# Altium project LightLink_V4.PrjPcb (part 1 of 3)
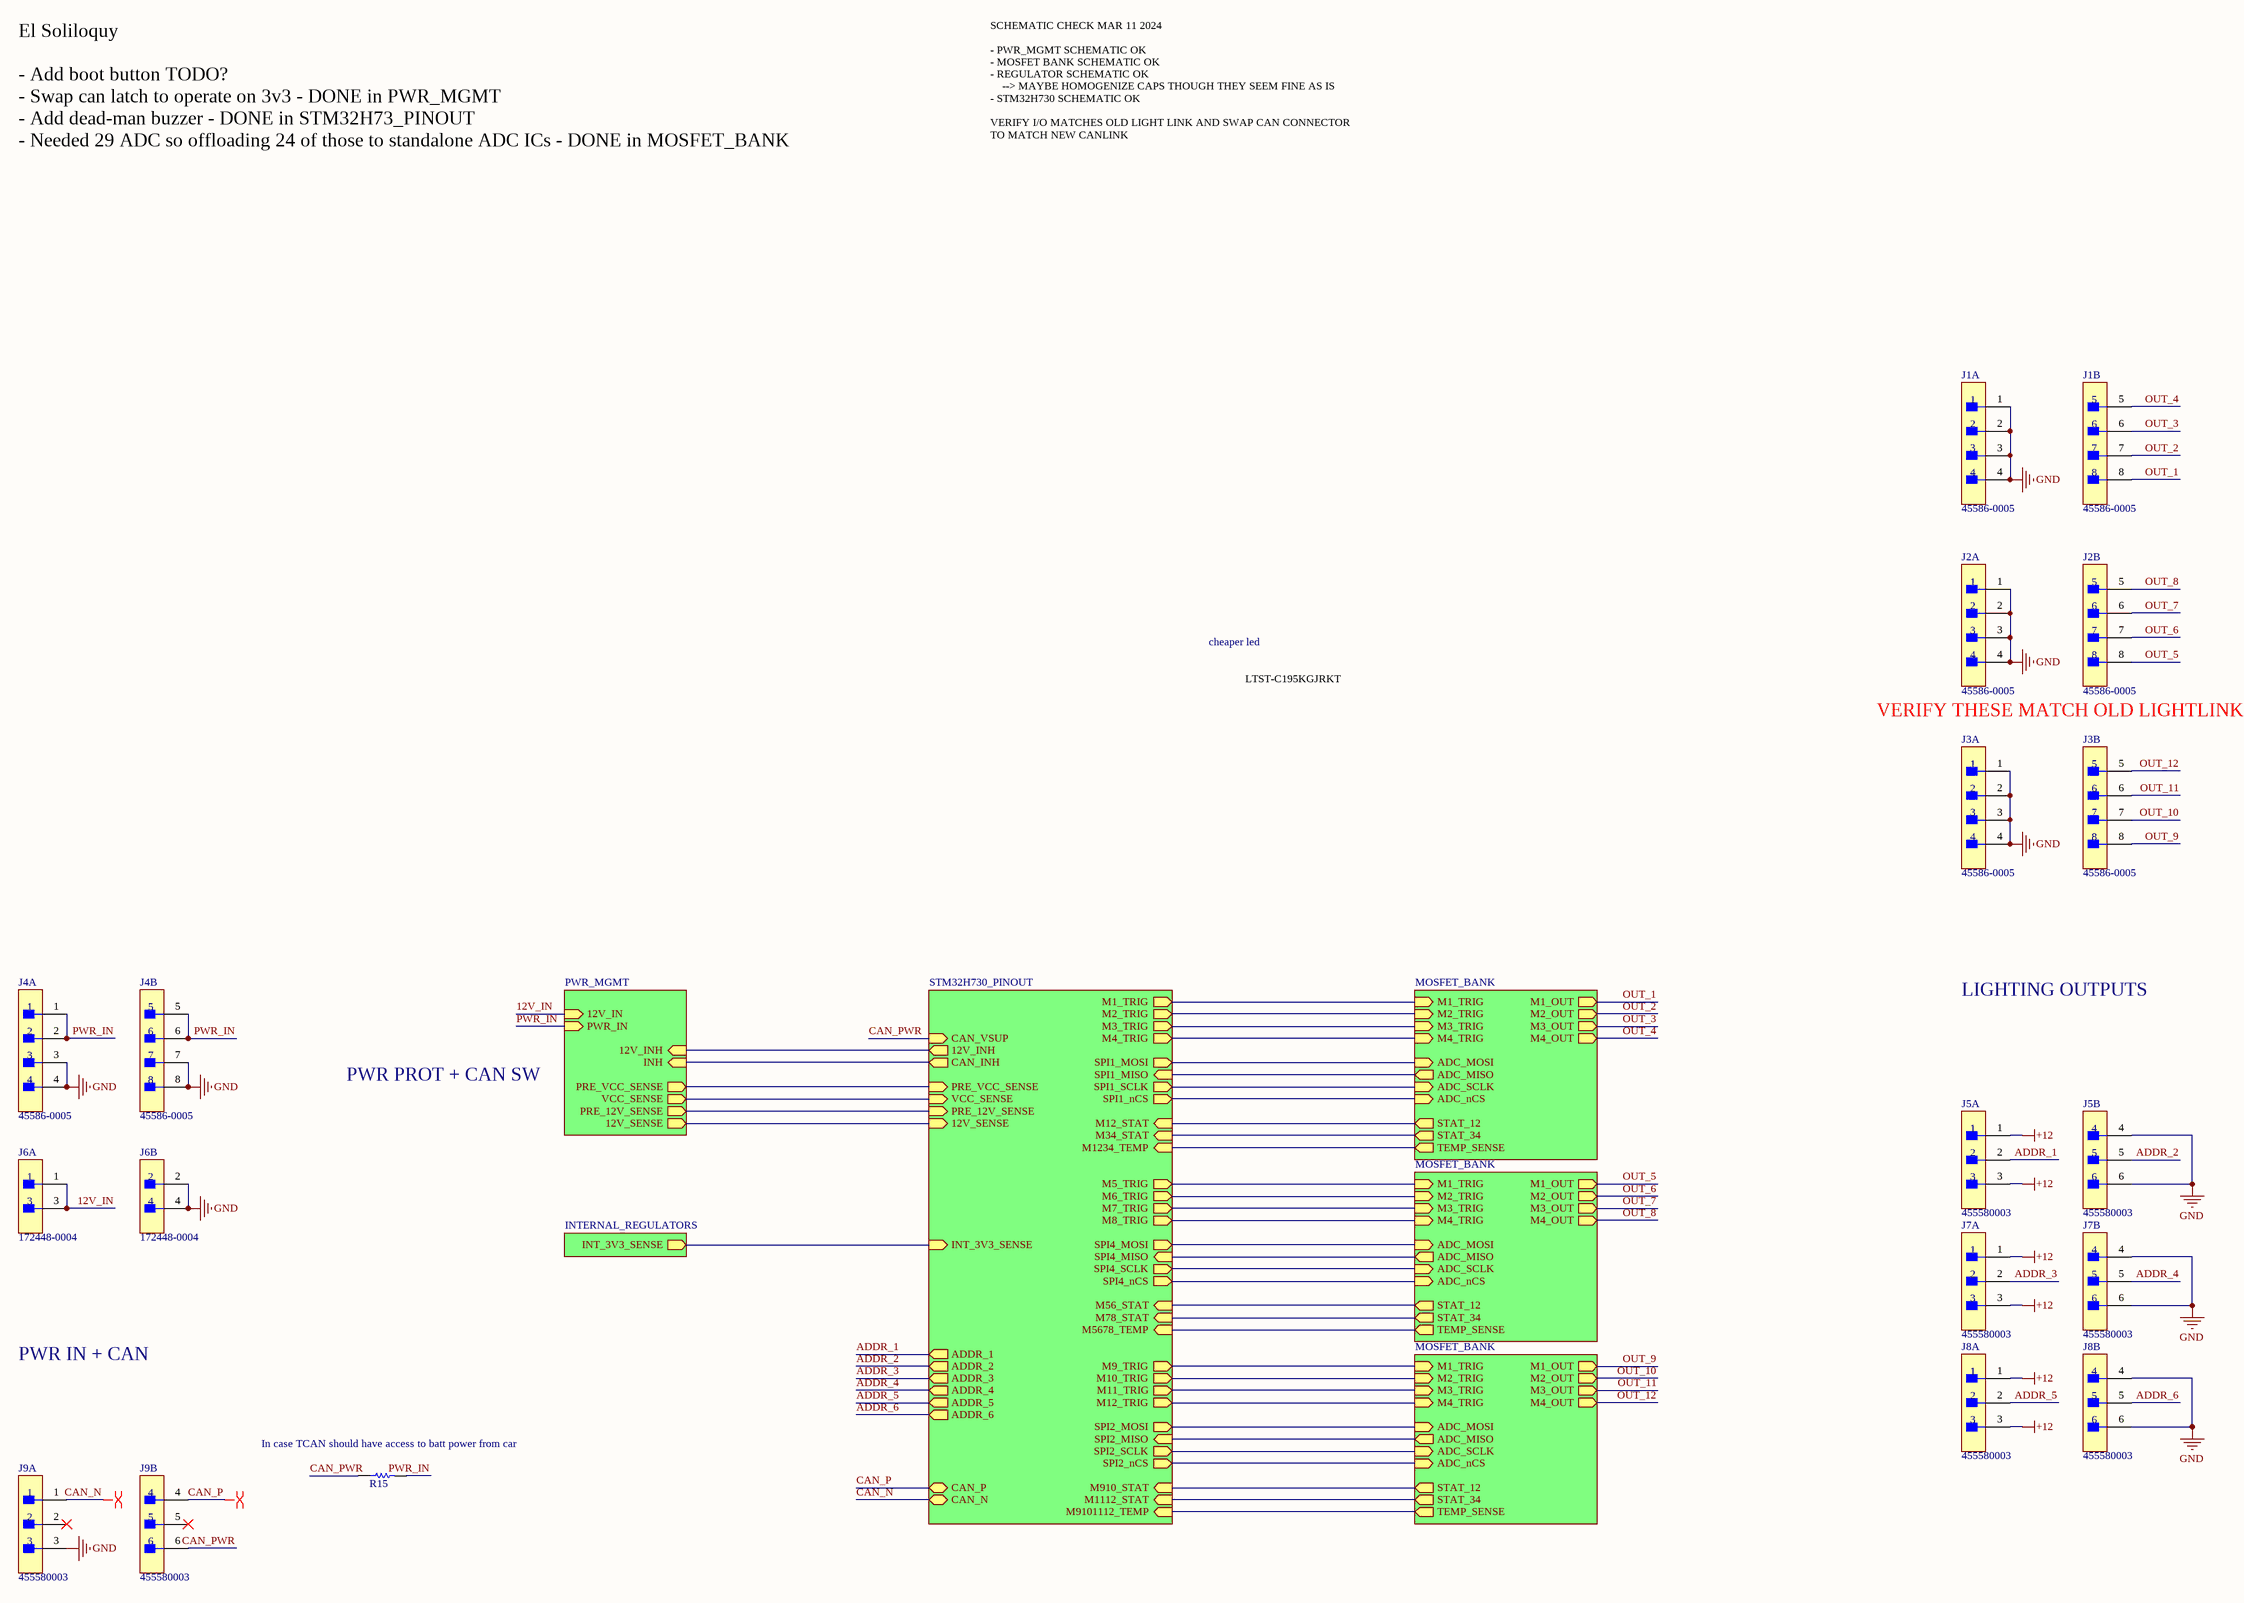
[diagram p0: LightLink_V4.SchDoc]
5 sheets, 331 parts. Net scope: hierarchical (ports join the sheet entries above them; power ports are global).
Board files: LightLink_V4.PcbDoc, LightLink_V4.1.PcbDoc
Sheets:
  LightLink_V4.SchDoc
    PWR_MGMT = PWR_MGMT.SchDoc
    INTERNAL_REGULATORS = INTERNAL_REGULATORS.SchDoc
    STM32H730_PINOUT = STM32H730_PINOUT.SchDoc
    MOSFET_BANK = MOSFET_BANK.SchDoc
    MOSFET_BANK = MOSFET_BANK.SchDoc
    MOSFET_BANK = MOSFET_BANK.SchDoc

## Sheet LightLink_V4.SchDoc
size C; SheetNumber: 1; SheetTotal: 5

### Parts
J1  45586-0005  [FP-45586-0005-MFG]  (parts A,B of 2)
J2  45586-0005  [FP-45586-0005-MFG]  (parts A,B of 2)
J3  45586-0005  [FP-45586-0005-MFG]  (parts A,B of 2)
J4  45586-0005  [FP-45586-0005-MFG]  (parts A,B of 2)
J5  455580003  [FP-455580003-MFG]  (parts A,B of 2)
J6  172448-0004  [FP-39-30-1041-MFG]  (parts A,B of 2)
J7  455580003  [FP-455580003-MFG]  (parts A,B of 2)
J8  455580003  [FP-455580003-MFG]  (parts A,B of 2)
J9  455580003  [FP-455580003-MFG]  (parts A,B of 2)
R15  0603 JUMPER  [RESC1609X55X30ML15T15]  (value not drawn)

### Sub-sheets
INTERNAL_REGULATORS = INTERNAL_REGULATORS: INT_3V3_SENSE (out)
MOSFET_BANK = MOSFET_BANK: M1_OUT (out), M2_OUT (out), M3_OUT (out), M4_OUT (out), M1_TRIG (in), M2_TRIG (in), M3_TRIG (in), M4_TRIG (in), STAT_12 (out), STAT_34 (out), ADC_MOSI (in), ADC_MISO (out), ADC_SCLK (in), ADC_nCS (in), TEMP_SENSE (out)
MOSFET_BANK = MOSFET_BANK: M1_OUT (out), M2_OUT (out), M3_OUT (out), M4_OUT (out), M1_TRIG (in), M2_TRIG (in), M3_TRIG (in), M4_TRIG (in), STAT_12 (out), STAT_34 (out), ADC_MOSI (in), ADC_MISO (out), ADC_SCLK (in), ADC_nCS (in), TEMP_SENSE (out)
MOSFET_BANK = MOSFET_BANK: M1_OUT (out), M2_OUT (out), M3_OUT (out), M4_OUT (out), M1_TRIG (in), M2_TRIG (in), M3_TRIG (in), M4_TRIG (in), STAT_12 (out), STAT_34 (out), ADC_MOSI (in), ADC_MISO (out), ADC_SCLK (in), ADC_nCS (in), TEMP_SENSE (out)
PWR_MGMT = PWR_MGMT: PWR_IN (in), 12V_IN (in), PRE_VCC_SENSE (out), VCC_SENSE (out), PRE_12V_SENSE (out), 12V_SENSE (out), INH (in), 12V_INH (in)
STM32H730_PINOUT = STM32H730_PINOUT: CAN_P (bidir), CAN_N (bidir), M1_TRIG (out), M2_TRIG (out), M3_TRIG (out), M4_TRIG (out), M12_STAT (in), M34_STAT (in), PRE_VCC_SENSE (in), VCC_SENSE (in), PRE_12V_SENSE (in), 12V_SENSE (in), M5_TRIG (out), M6_TRIG (out), M7_TRIG (out), M8_TRIG (out), M9_TRIG (out), M10_TRIG (out), M11_TRIG (out), M12_TRIG (out), M56_STAT (in), M78_STAT (in), M910_STAT (in), M1112_STAT (in), INT_3V3_SENSE (in), ADDR_1 (out), ADDR_2 (out), ADDR_3 (out), ADDR_4 (out), ADDR_5 (out), ADDR_6 (out), CAN_VSUP (in), CAN_INH (out), SPI1_MOSI (out), SPI1_MISO (in), SPI1_SCLK (out), SPI1_nCS (out), SPI4_MOSI (out), SPI4_MISO (in), SPI4_SCLK (out), SPI4_nCS (out), SPI2_MOSI (out), SPI2_MISO (in), SPI2_SCLK (out), SPI2_nCS (out), M1234_TEMP (in), M5678_TEMP (in), M9101112_TEMP (in), 12V_INH (out)

### Nets
+12: J5.1 J5.3 J7.1 J7.3 J8.1 J8.3
GND: J1.1 J1.2 J1.3 J1.4 J2.1 J2.2 J2.3 J2.4 J3.1 J3.2 J3.3 J3.4 J4.3 J4.4 J4.7 J4.8 J5.4 J5.6 J6.2 J6.4 J7.4 J7.6 J8.4 J8.6 J9.3
12V_IN: J6.1 J6.3 ; sheet PWR_MGMT/12V_IN
12V_INH: sheet PWR_MGMT/12V_INH, sheet STM32H730_PINOUT/12V_INH
12V_SENSE: sheet PWR_MGMT/12V_SENSE, sheet STM32H730_PINOUT/12V_SENSE
ADC_MISO: sheet STM32H730_PINOUT/SPI4_MISO, sheet MOSFET_BANK/ADC_MISO
ADC_MISO: sheet STM32H730_PINOUT/SPI1_MISO, sheet MOSFET_BANK/ADC_MISO  [a separate net that carries the same name]
ADC_MISO: sheet STM32H730_PINOUT/SPI2_MISO, sheet MOSFET_BANK/ADC_MISO  [a separate net that carries the same name]
ADC_MOSI: sheet STM32H730_PINOUT/SPI4_MOSI, sheet MOSFET_BANK/ADC_MOSI
ADC_MOSI: sheet STM32H730_PINOUT/SPI1_MOSI, sheet MOSFET_BANK/ADC_MOSI  [a separate net that carries the same name]
ADC_MOSI: sheet STM32H730_PINOUT/SPI2_MOSI, sheet MOSFET_BANK/ADC_MOSI  [a separate net that carries the same name]
ADC_nCS: sheet STM32H730_PINOUT/SPI4_nCS, sheet MOSFET_BANK/ADC_nCS
ADC_nCS: sheet STM32H730_PINOUT/SPI1_nCS, sheet MOSFET_BANK/ADC_nCS  [a separate net that carries the same name]
ADC_nCS: sheet STM32H730_PINOUT/SPI2_nCS, sheet MOSFET_BANK/ADC_nCS  [a separate net that carries the same name]
ADC_SCLK: sheet STM32H730_PINOUT/SPI4_SCLK, sheet MOSFET_BANK/ADC_SCLK
ADC_SCLK: sheet STM32H730_PINOUT/SPI1_SCLK, sheet MOSFET_BANK/ADC_SCLK  [a separate net that carries the same name]
ADC_SCLK: sheet STM32H730_PINOUT/SPI2_SCLK, sheet MOSFET_BANK/ADC_SCLK  [a separate net that carries the same name]
ADDR_1: J5.2 ; sheet STM32H730_PINOUT/ADDR_1
ADDR_2: J5.5 ; sheet STM32H730_PINOUT/ADDR_2
ADDR_3: J7.2 ; sheet STM32H730_PINOUT/ADDR_3
ADDR_4: J7.5 ; sheet STM32H730_PINOUT/ADDR_4
ADDR_5: J8.2 ; sheet STM32H730_PINOUT/ADDR_5
ADDR_6: J8.5 ; sheet STM32H730_PINOUT/ADDR_6
CAN_INH: sheet PWR_MGMT/INH, sheet STM32H730_PINOUT/CAN_INH
CAN_N: J9.1 ; sheet STM32H730_PINOUT/CAN_N
CAN_P: J9.4 ; sheet STM32H730_PINOUT/CAN_P
CAN_PWR: J9.6 R15.1 ; sheet STM32H730_PINOUT/CAN_VSUP
INT_3V3_SENSE: sheet INTERNAL_REGULATORS/INT_3V3_SENSE, sheet STM32H730_PINOUT/INT_3V3_SENSE
M1_TRIG: sheet STM32H730_PINOUT/M1_TRIG, sheet MOSFET_BANK/M1_TRIG
M2_TRIG: sheet STM32H730_PINOUT/M2_TRIG, sheet MOSFET_BANK/M2_TRIG
M3_TRIG: sheet STM32H730_PINOUT/M3_TRIG, sheet MOSFET_BANK/M3_TRIG
M4_TRIG: sheet STM32H730_PINOUT/M4_TRIG, sheet MOSFET_BANK/M4_TRIG
M5_TRIG: sheet STM32H730_PINOUT/M5_TRIG, sheet MOSFET_BANK/M1_TRIG
M6_TRIG: sheet STM32H730_PINOUT/M6_TRIG, sheet MOSFET_BANK/M2_TRIG
M7_TRIG: sheet STM32H730_PINOUT/M7_TRIG, sheet MOSFET_BANK/M3_TRIG
M8_TRIG: sheet STM32H730_PINOUT/M8_TRIG, sheet MOSFET_BANK/M4_TRIG
M9_TRIG: sheet STM32H730_PINOUT/M9_TRIG, sheet MOSFET_BANK/M1_TRIG
M10_TRIG: sheet STM32H730_PINOUT/M10_TRIG, sheet MOSFET_BANK/M2_TRIG
M11_TRIG: sheet STM32H730_PINOUT/M11_TRIG, sheet MOSFET_BANK/M3_TRIG
M12_STAT: sheet STM32H730_PINOUT/M12_STAT, sheet MOSFET_BANK/STAT_12
M12_TRIG: sheet STM32H730_PINOUT/M12_TRIG, sheet MOSFET_BANK/M4_TRIG
M34_STAT: sheet STM32H730_PINOUT/M34_STAT, sheet MOSFET_BANK/STAT_34
M56_STAT: sheet STM32H730_PINOUT/M56_STAT, sheet MOSFET_BANK/STAT_12
M78_STAT: sheet STM32H730_PINOUT/M78_STAT, sheet MOSFET_BANK/STAT_34
M910_STAT: sheet STM32H730_PINOUT/M910_STAT, sheet MOSFET_BANK/STAT_12
M1112_STAT: sheet STM32H730_PINOUT/M1112_STAT, sheet MOSFET_BANK/STAT_34
M1234_TEMP: sheet STM32H730_PINOUT/M1234_TEMP, sheet MOSFET_BANK/TEMP_SENSE
M5678_TEMP: sheet STM32H730_PINOUT/M5678_TEMP, sheet MOSFET_BANK/TEMP_SENSE
M9101112_TEMP: sheet STM32H730_PINOUT/M9101112_TEMP, sheet MOSFET_BANK/TEMP_SENSE
OUT_1: J1.8 ; sheet MOSFET_BANK/M1_OUT  [project net M1_OUT]
OUT_2: J1.7 ; sheet MOSFET_BANK/M2_OUT  [project net M2_OUT]
OUT_3: J1.6 ; sheet MOSFET_BANK/M3_OUT  [project net M3_OUT]
OUT_4: J1.5 ; sheet MOSFET_BANK/M4_OUT  [project net M4_OUT]
OUT_5: J2.8 ; sheet MOSFET_BANK/M1_OUT  [project net M1_OUT]
OUT_6: J2.7 ; sheet MOSFET_BANK/M2_OUT  [project net M2_OUT]
OUT_7: J2.6 ; sheet MOSFET_BANK/M3_OUT  [project net M3_OUT]
OUT_8: J2.5 ; sheet MOSFET_BANK/M4_OUT  [project net M4_OUT]
OUT_9: J3.8 ; sheet MOSFET_BANK/M1_OUT  [project net M1_OUT]
OUT_10: J3.7 ; sheet MOSFET_BANK/M2_OUT  [project net M2_OUT]
OUT_11: J3.6 ; sheet MOSFET_BANK/M3_OUT  [project net M3_OUT]
OUT_12: J3.5 ; sheet MOSFET_BANK/M4_OUT  [project net M4_OUT]
PRE_12V_SENSE: sheet PWR_MGMT/PRE_12V_SENSE, sheet STM32H730_PINOUT/PRE_12V_SENSE
PRE_VCC_SENSE: sheet PWR_MGMT/PRE_VCC_SENSE, sheet STM32H730_PINOUT/PRE_VCC_SENSE
PWR_IN: J4.1 J4.2 J4.5 J4.6 R15.2 ; sheet PWR_MGMT/PWR_IN
VCC_SENSE: sheet PWR_MGMT/VCC_SENSE, sheet STM32H730_PINOUT/VCC_SENSE

Not connected (* = marked no-connect by the designer): J9 2* 5*

### Layout directives
differential pair: CAN_N, CAN_P

### Notes on the sheet
- SCHEMATIC CHECK MAR 11 2024
  - PWR_MGMT SCHEMATIC OK
  - MOSFET BANK SCHEMATIC OK
  - REGULATOR SCHEMATIC OK
  --> MAYBE HOMOGENIZE CAPS THOUGH THEY SEEM FINE AS IS
  - STM32H730 SCHEMATIC OK
  VERIFY I/O MATCHES OLD LIGHT LINK AND SWAP CAN CONNECTOR TO MATCH NEW CANLINK
- cheaper led
- LTST-C195KGJRKT
- (near J2) VERIFY THESE MATCH OLD LIGHTLINK
- El Soliloquy
  - Add boot button TODO?
  - Swap can latch to operate on 3v3 - DONE in PWR_MGMT
  - Add dead-man buzzer - DONE in STM32H73_PINOUT
  - Needed 29 ADC so offloading 24 of those to standalone ADC ICs - DONE in MOSFET_BANK
- LIGHTING OUTPUTS
- PWR PROT + CAN SW
- PWR IN + CAN
- (near R15) In case TCAN should have access to batt power from car

### Library data of the parts
J1-J4 = CMP-04776-000690-1: CONN HEADER R/A 8POS 4.2MM
J5 J7-J9 = CMP-04776-000024-1: CONN HEADER R/A 6POS 4.2MM; Manufacturer: Molex; Standoff Height: 0.4mm; Conn Orientation: Right Angle; Number Of Contacts: 6; Conn Gender: Male; Voltage Rating: 600V; Current Rating: 8A; Footprint Url: https://www.molex.com/pdm_docs/sd/455580003_sd.pdf; Number Of Rows: 2; Lead Free: Yes; Digikey Description: CONN HEADER R/A 6POS 4.2MM; ComponentLink2URL: https://www.molex.com/webdocs/datasheets/pdf/en-us/0455580003_PCB_HEADERS.pdf; Octopart: https://octopart.com/45558-0003-molex-7672845; Package: 0; Device Class L3: unset; ComponentLink2Description: Datasheet; Device Class L2: Headers and Wire Housings; Category: Conn; Contact Material: Tin,Nickel; Mouser Description: Conn Power HDR 6 POS 4.2mm Solder ST Thru-Hole 6 Terminal 1 Port Mini-Fit Jr™ Tray; Manufacturer Part Number: 455580003; Pitch: 4.2mm; Device Class L1: Connectors; Temperature Range Low: -40°C; Temperature: -40°C to +105°C; RoHS: TRUE; Temperature Range High: +105°C; Height: 10.38mm; Automotive: No
J6 = CMP-04776-000047-1: Different component but holes should line up. Original P/N is 39-30-1041; Manufacturer: Molex; Old_Part_Number: 5569-04A2G; Keying_to_Mating_Part: None; Circuits_maximum: 4; First_Mate__Last_Break: No; Lead_freeProcess_Capability: WAVE; Duration_at_Max_Process_Temperature_seconds: 005; Sales_Drawing: SDA-5569-NA2*-*; Current Rating: 13A; Material___Plating_Mating: Gold; Conn Gender: Male; Test_Summary: TS-5556-002; Color___Resin: Natural; Termination_Interface_Style: Through Hole; Pitch___Termination_Interface: 4.20mm; UL: E29179; PCB_Retention: Yes; Product_Name: Mini-Fit Jr.TM; Material___Resin: Nylon; Overview: Mini-Fit Jr. Power Connectors; CSA: LR19980; Plating_min___Termination: 2.540μm; Packaging_Type: Bag; Number_of_Rows: 2; Durability_mating_cycles_max: 30; Max_Cycles_at_Max_Process_Temperature: 001; Product_Specification: PS-45750-001, PS-5556-001; Net_Weight: 1.529/g; Voltage___Maximum: 600V; Material___Metal: Brass; Pitch: 4.2mm; Packaging_Specification: PK-5569-002; Shrouded: Fully; Plating_min___Mating: 0.762μm; Temperature_Range___Operating: -40°C to +105°C; Current___Maximum_per_Contact: 13.0A; Comments: Current = 13A max. per circuit when header is mated to a receptacle loaded with  45750  Mini-Fit® Plus HCS Crimp Terminal Crimped to 16 AWG wire.,  See Molex Product specification PS-5556-001 for additional current de-rating information.; Process_Temperature_max_C: 240; PCB_Thickness___Recommended: 1.78mm; Standoff Height: 0.016inch; Surface_Mount_Compatible_SMC: No; UPC: 800753579651; Conn Orientation: Right Angle; Material___Plating_Termination: Matte Tin; ComponentLink2Description: Datasheet; Footprint Url: https://www.molex.com/pdm_docs/sd/039301041_sd.pdf; Contact Material: Gold,Nickel; Octopart: https://octopart.com/39-30-1041-molex-276737; Digikey Description: CONN HEADER R/A 4POS 4.2MM; imported: yes; Series: 5569; Mouser Description: Headers & Wire Housings 4 CKT R/A HEADER; Temperature Range High: +105°C; Category: Conn; Polarized_to_Mating_Part: Yes; Pitch___Mating_Interface: 4.20mm; Automotive: No; Guide_to_Mating_Part: No; Lock_to_Mating_Part: Yes; Number Of Contacts: 4; Temperature Range Low: -40°C; RoHS: TRUE; Status: Active; imported_from: 3D Model; ComponentLink2URL: http://www.molex.com/pdm_docs/sd/039301041_sd.pdf; part_page: http://www.molex.com/molex/products/datasheet.jsp?part=active/0039301041_PCB_HEADERS.xml; Temperature: -40°C to +105°C; Device Class L3: unset; Device Class L1: Connectors; Package: 39-30-1041; Circuits_Loaded: 4; Lead Free: Yes; Ipc Land Pattern Name: CAPAD1016W80L630D240; Application: Power, Wire-to-Board; Voltage Rating: 600V; Manufacturer Part Number: 39-30-1041; Breakaway: No; Orientation: Right Angle; Flammability: 94V-2; 3D_model: http://www.molex.com/pdm_docs/stp/39-30-1041_stp.zip; Number Of Rows: 2; Polarized_to_PCB: Yes; Device Class L2: Headers and Wire Housings; Glow_Wire_Compliant: No; Stackable: No; PCB_Locator: Yes
R15 = CMP-009-00209-1: READ THE NAME

## Sheet PWR_MGMT.SchDoc
size C; SheetNumber: 2; SheetTotal: 5
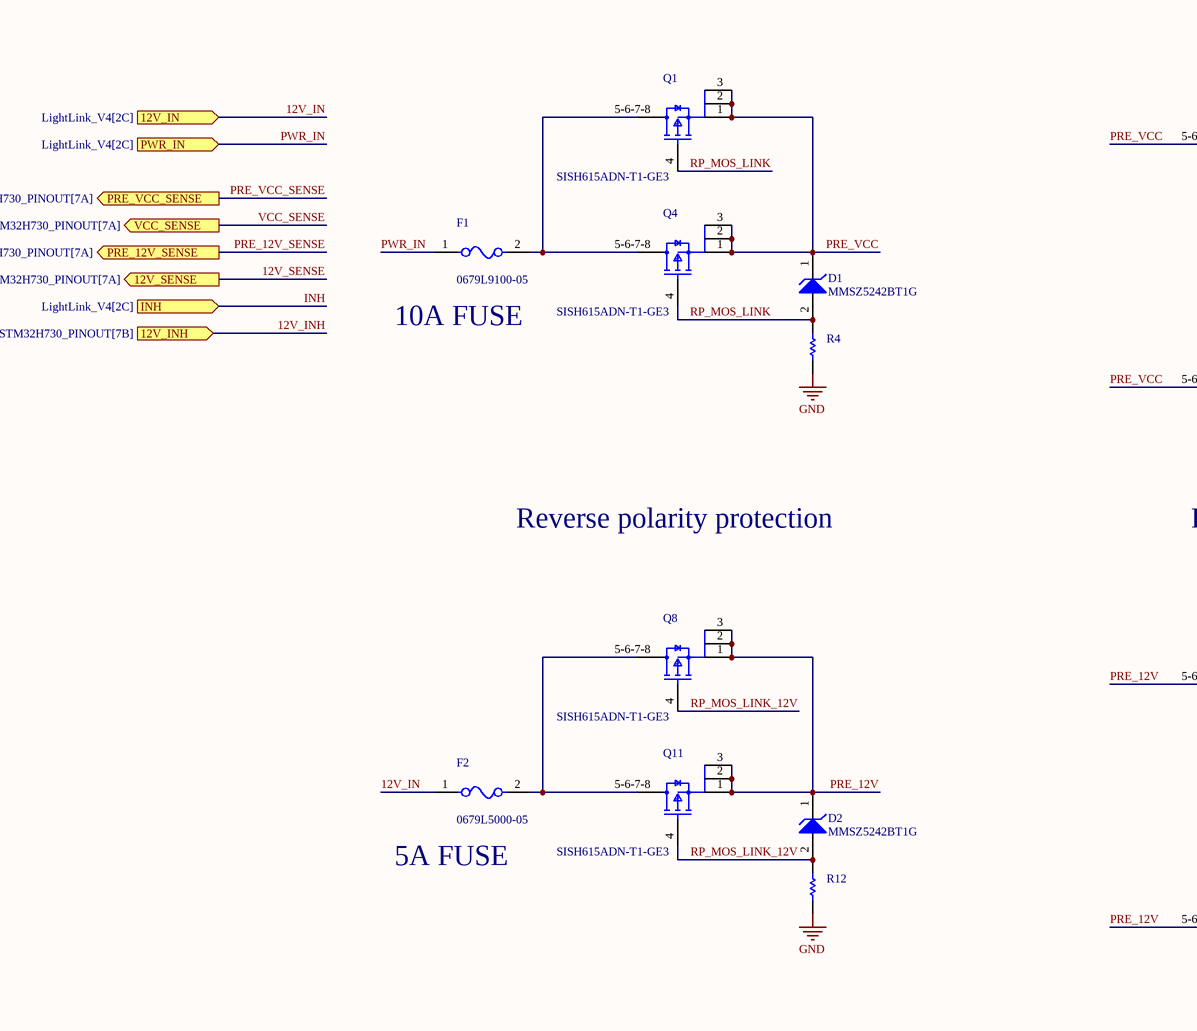
[diagram p1: PWR_MGMT.SchDoc, left]
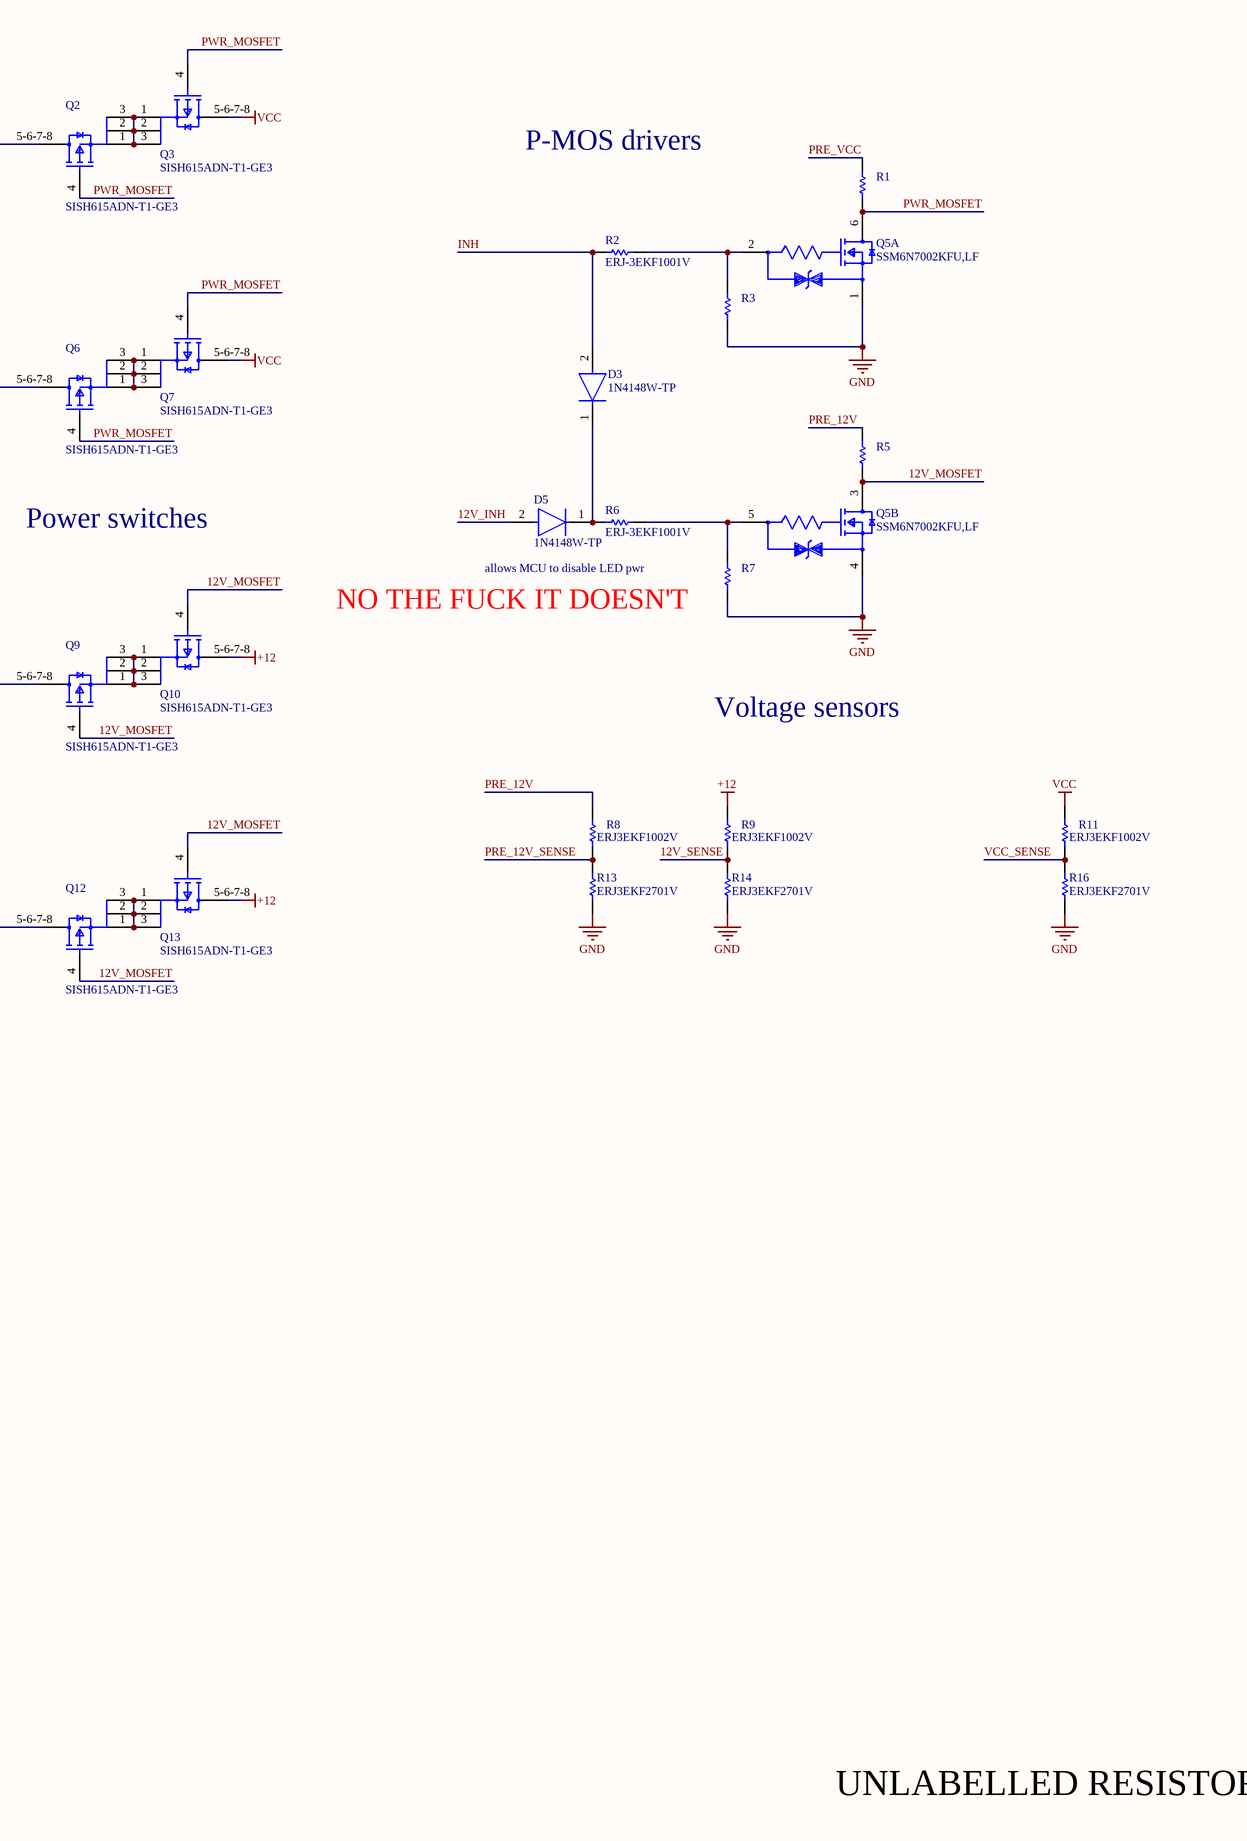
[diagram p2: PWR_MGMT.SchDoc, right]

### Parts
D1  MMSZ5242BT1G  [ONSC-SOD-123-2-425-04_V]
D2  MMSZ5242BT1G  [ONSC-SOD-123-2-425-04_V]
D3  1N4148W-TP  [FP-SOD-123-IPC_A]
D5  1N4148W-TP  [FP-SOD-123-IPC_A]
F1  0679L9100-05  [FP-0679L-MFG]
F2  0679L5000-05  [FP-0679L-MFG]
Q1  SISH615ADN-T1-GE3  [SISH615ADN-T1-GE3-Footprint-1]
Q2  SISH615ADN-T1-GE3  [SISH615ADN-T1-GE3-Footprint-1]
Q3  SISH615ADN-T1-GE3  [SISH615ADN-T1-GE3-Footprint-1]
Q4  SISH615ADN-T1-GE3  [SISH615ADN-T1-GE3-Footprint-1]
Q5  SSM6N7002KFU,LF  [FP-SSOP6-P-0_65A-MFG]  (parts A,B of 2)
Q6  SISH615ADN-T1-GE3  [SISH615ADN-T1-GE3-Footprint-1]
Q7  SISH615ADN-T1-GE3  [SISH615ADN-T1-GE3-Footprint-1]
Q8  SISH615ADN-T1-GE3  [SISH615ADN-T1-GE3-Footprint-1]
Q9  SISH615ADN-T1-GE3  [SISH615ADN-T1-GE3-Footprint-1]
Q10  SISH615ADN-T1-GE3  [SISH615ADN-T1-GE3-Footprint-1]
Q11  SISH615ADN-T1-GE3  [SISH615ADN-T1-GE3-Footprint-1]
Q12  SISH615ADN-T1-GE3  [SISH615ADN-T1-GE3-Footprint-1]
Q13  SISH615ADN-T1-GE3  [SISH615ADN-T1-GE3-Footprint-1]
R1  ERJ3EKF1002V  [RESC1609X55X30LL15T15]  (value not drawn)
R2  ERJ-3EKF1001V  [RESC1608X55X30LL15T15]
R3  ERJ3EKF1002V  [RESC1609X55X30LL15T15]  (value not drawn)
R4  ERJ3EKF1002V  [RESC1609X55X30LL15T15]  (value not drawn)
R5  ERJ3EKF1002V  [RESC1609X55X30LL15T15]  (value not drawn)
R6  ERJ-3EKF1001V  [RESC1608X55X30LL15T15]
R7  ERJ3EKF1002V  [RESC1609X55X30LL15T15]  (value not drawn)
R8  ERJ3EKF1002V  [RESC1609X55X30LL15T15]
R9  ERJ3EKF1002V  [RESC1609X55X30LL15T15]
R11  ERJ3EKF1002V  [RESC1609X55X30LL15T15]
R12  ERJ3EKF1002V  [RESC1609X55X30LL15T15]  (value not drawn)
R13  ERJ3EKF2701V  [RESC1608X55X30LL15T15]
R14  ERJ3EKF2701V  [RESC1608X55X30LL15T15]
R16  ERJ3EKF2701V  [RESC1608X55X30LL15T15]

### Ports
12V_IN (in, see LightLink_V4[2C]), 12V_INH (in, see LightLink_V4[2C], STM32H730_PINOUT[7B]), 12V_SENSE (out, see LightLink_V4[2C], STM32H730_PINOUT[7A]), INH (in, see LightLink_V4[2C]), PRE_12V_SENSE (out, see LightLink_V4[2C], STM32H730_PINOUT[7A]), PRE_VCC_SENSE (out, see LightLink_V4[2C], STM32H730_PINOUT[7A]), PWR_IN (in, see LightLink_V4[2C]), VCC_SENSE (out, see LightLink_V4[2C], STM32H730_PINOUT[7A])

### Nets
+12: Q10.5-6-7-8(D) Q13.5-6-7-8(D) R9.1
GND: Q5.1(Source1) Q5.4(Source2) R3.2 R4.2 R7.2 R12.2 R13.1 R14.1 R16.1
VCC: Q3.5-6-7-8(D) Q7.5-6-7-8(D) R11.1
12V_IN: F2.1 ; port 12V_IN
12V_INH: D5.2(A) ; port 12V_INH
12V_MOSFET: Q5.3(Drain2) Q9.4(G) Q10.4(G) Q12.4(G) Q13.4(G) R5.2
12V_SENSE: R9.2 R14.2 ; port 12V_SENSE
INH: D3.2(A) R2.1 ; port INH  [project net CAN_INH]
PRE_12V: D2.1(K) Q8.1(S) Q8.2(S) Q8.3(S) Q9.5-6-7-8(D) Q11.1(S) Q11.2(S) Q11.3(S) Q12.5-6-7-8(D) R5.1 R8.1
PRE_12V_SENSE: R8.2 R13.2 ; port PRE_12V_SENSE
PRE_VCC: D1.1(K) Q1.1(S) Q1.2(S) Q1.3(S) Q2.5-6-7-8(D) Q4.1(S) Q4.2(S) Q4.3(S) Q6.5-6-7-8(D) R1.1
PRE_VCC_SENSE: port PRE_VCC_SENSE
PWR_IN: F1.1 ; port PWR_IN
PWR_MOSFET: Q2.4(G) Q3.4(G) Q5.6(Drain1) Q6.4(G) Q7.4(G) R1.2
RP_MOS_LINK: D1.2(A) Q1.4(G) Q4.4(G) R4.1
RP_MOS_LINK_12V: D2.2(A) Q8.4(G) Q11.4(G) R12.1
VCC_SENSE: R11.2 R16.2 ; port VCC_SENSE
NetD3_1: D3.1(C) D5.1(C) R6.1
NetF1_2: F1.2 Q1.5-6-7-8(D) Q4.5-6-7-8(D)
NetF2_2: F2.2 Q8.5-6-7-8(D) Q11.5-6-7-8(D)
NetQ2_1: Q2.1(S) Q2.2(S) Q2.3(S) Q3.1(S) Q3.2(S) Q3.3(S)
NetQ5_2: Q5.2(Gate1) R2.2 R3.1
NetQ5_5: Q5.5(Gate2) R6.2 R7.1
NetQ6_1: Q6.1(S) Q6.2(S) Q6.3(S) Q7.1(S) Q7.2(S) Q7.3(S)
NetQ9_1: Q9.1(S) Q9.2(S) Q9.3(S) Q10.1(S) Q10.2(S) Q10.3(S)
NetQ12_1: Q12.1(S) Q12.2(S) Q12.3(S) Q13.1(S) Q13.2(S) Q13.3(S)

### Notes on the sheet
- P-MOS drivers
- (near F1) 10A FUSE
- Reverse polarity protection
- Power switches
- NO THE FUCK IT DOESN'T
- allows MCU to disable LED pwr
- Voltage sensors
- (near F2) 5A FUSE
- UNLABELLED RESISTORS ARE 10K

### Library data of the parts
D1 D2 = CMP-1060-00565-1: Zener Voltage Regulator, 500 mW, 2-Pin SOD-123, Pb-Free, Tape and Reel; Manufacturer: On Semiconductor; P Max (W): 0.5; VZ Typ (V): 12; PartNumber: MMSZ5242BT1G; PackageReference: SOD-123-2-425-04; ComponentLink3URL: http://www.onsemi.com/pub_link/Collateral/425-04.PDF; Mounting Technology: Surface Mount; ComponentLink2Description: Datasheet; ComponentLink1URL: http://www.onsemi.com/; ComponentLink3Description: Package Specification; PackageDescription: 2-Pin SOD, Body 1.6 x 2.69 mm; PackageVersion: Rev. G, 10/2009; ComponentLink1Description: Manufacturer URL; RoHS: Pb-Free; ComponentLink2URL: http://www.onsemi.com/pub_link/Collateral/MMSZ5221BT1-D.PDF; Packing: Tape and Reel; DatasheetVersion: Rev. 12
D3 D5 = CMP-2000-04993-2: DIODE GEN PURP 100V 150MA SOD123; Max Reverse Leakage Current: 5uA; Max Surge Current: 2A; Reverse Recovery Time: 4ns; Polarity: Standard; Capacitance: 4pF; Max Forward Surge Current (Ifsm): 1A; Element Configuration: Single; Power Dissipation: 400mW; Forward Voltage: 1V; Radiation Hardening: No; Lead Free: Lead Free; Max Reverse Voltage (DC): 100V; Current Rating: 150mA; Forward Current: 150mA; Packaging: Tape and Reel; Number of Pins: 2; Package Quantity: 3000; Max Operating Temperature: 150°C; Min Operating Temperature: -65°C; Average Rectified Current: 150mA; Recovery Time: 4ns; Output Current: 150mA; Peak Non-Repetitive Surge Current: 2A; Width: 1.8mm; Voltage Rating (DC): 100V; Height: 1.2mm; Max Repetitive Reverse Voltage (Vrrm): 100V; Mount: Surface Mount; Length: 2.85mm
F1 = CMP-16042-000002-1: DIFF P#!!! / FUSE BRD MNT 10A 125VAC/VDC; Manufacturer: Bel Fuse; Manufacturer Part Number: 0679L9150-01; Max Fuse Ac Voltage: 125V; Fuse Blow Speed: Fast; Fuse Current: 15A; Fuse I2T: 103.5A2Sec; Fuse Interrupt Ac Current: 50A; Automotive Grade: Grade 1; Value: 0.0038Ω; Fuse Interrupt Dc Current: 300A; Fuse Voltage Drop: 0.13V; Device Class L2: Fuses; ComponentLink2URL: https://www.belfuse.com/resources/CircuitProtection/datasheets/0679L%20Sep2016.pdf; Package: 0679L; Height: 2.79mm; Digikey Description: FUSE BRD MNT 15A 125VAC/VDC; Temperature Range High: +125°C; Device Class L3: unset; Octopart: https://octopart.com/0679l9150-01-bel+fuse-70850665; Temperature Range Low: -55°C; Max Fuse Dc Voltage: 125V; Ipc Land Pattern Name: CAPC610254X254; Category: Fuse; Lead Free: Yes; Automotive: Yes; Resistance: 0.0038Ω; RoHS: TRUE; Device Class L1: Circuit Protection; ComponentLink2Description: Datasheet; Temperature: -55°C to +125°C; Voltage Rating: 125V
F2 = CMP-16042-000002-1: DIFF P#!!! / FUSE BRD MNT 5A 125VAC/VDC; Manufacturer: Bel Fuse; Manufacturer Part Number: 0679L9150-01; Max Fuse Ac Voltage: 125V; Fuse Blow Speed: Fast; Fuse Current: 15A; Fuse I2T: 103.5A2Sec; Fuse Interrupt Ac Current: 50A; Automotive Grade: Grade 1; Value: 0.0038Ω; Fuse Interrupt Dc Current: 300A; Fuse Voltage Drop: 0.13V; Device Class L2: Fuses; ComponentLink2URL: https://www.belfuse.com/resources/CircuitProtection/datasheets/0679L%20Sep2016.pdf; Package: 0679L; Height: 2.79mm; Digikey Description: FUSE BRD MNT 15A 125VAC/VDC; Temperature Range High: +125°C; Device Class L3: unset; Octopart: https://octopart.com/0679l9150-01-bel+fuse-70850665; Temperature Range Low: -55°C; Max Fuse Dc Voltage: 125V; Ipc Land Pattern Name: CAPC610254X254; Category: Fuse; Lead Free: Yes; Automotive: Yes; Resistance: 0.0038Ω; RoHS: TRUE; Device Class L1: Circuit Protection; ComponentLink2Description: Datasheet; Temperature: -55°C to +125°C; Voltage Rating: 125V
Q1-Q4 Q6-Q13 = CMP-013-00036-2: Trans MOSFET P-CH 20V 22.1A 8-Pin PowerPAK 1212 EP T/R
Q5 = CMP-35916-000009-1: MOSFET 2N-CH 60V 0.3A; Input Capacitance: 40pF; Continuous Drain Current (ID): 300mA; Max Power Dissipation: 285mW; FET Type: 2 N-Channel; Rds On Max: 1.5R; Mount: Surface Mount; Drain to Source Voltage (Vdss): 60V; Packaging: Tape and Reel
R1 R3-R5 R7-R9 R11 R12 = CMP-1012-00623-3: Chip Resistor, 10 KOhm, +/- 1%, 0.1 W, -55 to 155 degC, 0603 (1608 Metric), RoHS, Tape and Reel; Manufacturer: Panasonic; Voltage Rating: 75V; Case\/Package: 0603; Power Rating: 100mW; Resistance: 10KOhm; Temperature Coefficient: 100ppm\/degreesC; Number of Pins: 2; Package Reference: 603; Depth: 0.8mm; Mount: SurfaceMount; Package Description: 2-Pin Surface Mount Device, Body 1.6 x 0.85 mm; Datasheet Version: 02/2017; Length: 1.6mm; Lead Free: LeadFree; Height: 0.45mm; Number of Terminations: 2; Max Power Dissipation: 100mW; Min Operating Temperature: -55degC; Datasheet URL: https://industrial.panasonic.com/cdbs/www-data/pdf/RDA0000/AOA0000C304.pdf; Termination: SMD/SMT; Case Code (Metric): 1608; Case Code (Imperial): 0603; Tolerance: 1%; Max Operating Temperature: 155degC; RoHSCompliant: true; Voltage Rating (DC): 75V; Radiation Hardening: No; Packaging: TapeandReel; Composition: ThickFilm; Mounting Technology: SurfaceMount; Manufacturer URL: http://www.panasonic.com/; Width: 0.031inch; REACH SVHC: NoSVHC; Contact Plating: Tin; Military Standard: Not; Package Quantity: 1
R2 R6 = CMP-2000-00180-1: Manufacturer: Panasonic; Part Number: ERJ-3EKF1001V
R13 R14 R16 = CMP-2000-00389-1: Manufacturer: Panasonic; Part Number: ERJ3EKF2701V

## Sheet INTERNAL_REGULATORS.SchDoc
size E; SheetNumber: 4; SheetTotal: 5
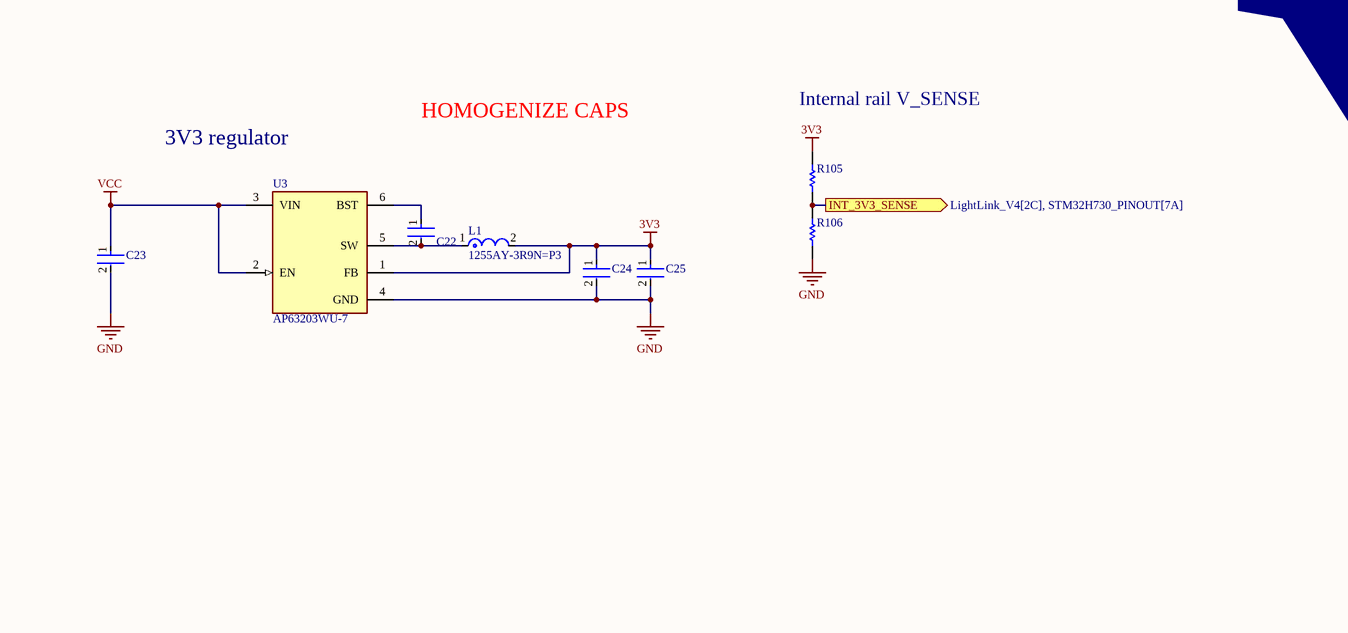
[diagram p3: INTERNAL_REGULATORS.SchDoc, top left]
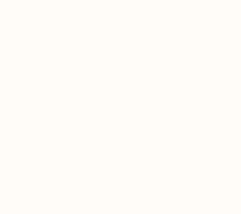
[diagram p4: INTERNAL_REGULATORS.SchDoc, bottom left]
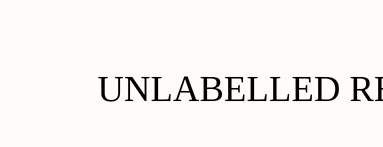
[diagram p5: INTERNAL_REGULATORS.SchDoc, bottom middle]

### Parts
C22  C0402C104K8PACTU  [FP-C0402-BB-MFG]  (value not drawn)
C23  GRM188R60J106ME47D  [FP-GRM188-0_1-e0_2_0_55-IPC_A]  (value not drawn)
C24  GRM21BR61E226ME44L  [FP-GRM21B-0_2-e0_2_0_7-IPC_B]  (value not drawn)
C25  GRM21BR61E226ME44L  [FP-GRM21B-0_2-e0_2_0_7-IPC_B]  (value not drawn)
L1  1255AY-3R9N=P3  [FP-DG6045C-MFG]
R105  ERJ3EKF1002V  [RESC1609X55X30LL15T15]  (value not drawn)
R106  ERJ3EKF1002V  [RESC1609X55X30LL15T15]  (value not drawn)
U3  AP63203WU-7  [FP-TSOT26-MFG]

### Ports
INT_3V3_SENSE (out, see LightLink_V4[2C], STM32H730_PINOUT[7A])

### Nets
3V3: C24.1 C25.1 L1.2 R105.2 U3.1(FB)
GND: C23.2 C24.2 C25.2 R106.1 U3.4(GND)
VCC: C23.1 U3.2(EN) U3.3(VIN)
INT_3V3_SENSE: R105.1 R106.2 ; port INT_3V3_SENSE
NetC22_1: C22.1 U3.6(BST)
NetC22_2: C22.2 L1.1 U3.5(SW)

### Notes on the sheet
- 3V3 regulator
- HOMOGENIZE CAPS
- Internal rail V_SENSE
- Yep
- That's all folks
- UNLABELLED RESISTORS ARE 10K

### Library data of the parts
C22 = CMP-2008-02046-2: CAP CER 0.1UF 10V X5R 0402; Manufacturer: Kemet; Material: Ceramic; Capacitance: 0.10 μF; Temperature Coefficient: 15%; Tolerance: 0.1; Value: 0.10 μF; Package: C0402-BB; Temperature: -55°C to +125°C; ComponentLink2Description: Datasheet; Temperature Characteristic: X5R; Device Class L1: Passive Components; Height: 0.55mm; Lead Free: Yes; ComponentLink2URL: https://content.kemet.com/datasheets/KEM_C1002_X7R_SMD.pdf; Device Class L2: Capacitors; Temperature Range Low: -55°C; Temperature Range High: +125°C; RoHS: TRUE; Octopart: https://octopart.com/c0402c104k8pactu-kemet-140039; Automotive: No; Mouser Description: Capacitor 100 nF 10 VDC 0402; Category: Cap; Voltage Rating: 10 V; Digikey Description: CAP CER 0.1UF 10V X5R 0402; Ipc Land Pattern Name: CAPC10050X50; Device Class L3: Ceramic Capacitors; Manufacturer Part Number: C0402C104K8PACTU
C23 = CMP-2006-02792-2: Chip Multilayer Ceramic Capacitors for General Purpose, 0603, 10uF, X5R, 15%, 20%, 6.3V; Packaging: Tape and Reel; Voltage Rating (DC): 6.3V; Width: 0.031inch; Termination: SMD/SMT; Dielectric: X5R; Package Quantity: 4000; Voltage Rating: 6.3V; Capacitance: 10uF; Case/Package: 0603; Min Operating Temperature: -55°C; Voltage: 6.3V; Length: 1.6mm; Thickness: 0.035inch; Lead Free: Lead Free; Depth: 0.8mm; Case Code (Imperial): 0603; Max Operating Temperature: 85°C; Material: Ceramic; Height: 0.8mm; Tolerance: 20%; Mount: Surface Mount; REACH SVHC: No SVHC; Radiation Hardening: No; Case Code (Metric): 1608
C24 C25 = CMP-2007-03222-3: Chip Multilayer Ceramic Capacitors for General Purpose, 0805, 22uF, X5R, 15%, 20%, 25V; Case/Package: 0805; Depth: 1.25mm; Resistor Type: Ceramic; Voltage Rating: 25V; Lead Free: Lead Free; Voltage Rating (DC): 25V; Case Code (Metric): 2012; Thickness: 0.057inch; REACH SVHC: No SVHC; Material: Ceramic; Tolerance: 20%; Length: 2mm; Capacitance: 22uF; Case Code (Imperial): 0805; Max Operating Temperature: 85°C; Termination: SMD/SMT; Weight: 0.000335oz; Dielectric: X5R; Packaging: Tape and Reel; Voltage: 25V; Package Quantity: 3000; Height: 1.25mm; Mount: Surface Mount; Width: 1.25mm; Min Operating Temperature: -55°C
L1 = CMP-06042-002684-1: Shielded Wirewound Inductor 3.9uH 30% 4200mA 0.0264Ω SMD; Saturation Current: 4.7A; Test Frequency: 100kHz; Core Material: Ferrite; Current Rating: 4.2A; DC Resistance (DCR): 26.4mR; Inductance: 3.9uH; Resistor Type: Wirewound; Width: 0.248inch; Mount: Surface Mount; Tolerance: 30%; Packaging: Tape and Reel; Max Operating Temperature: 85°C; Shielding: Shielded; Length: 0.248inch; Min Operating Temperature: -40°C; Height - Seated (Max): 0.177inch; Case/Package: Nonstandard
R105 R106 = CMP-1012-00623-3: as R1 on sheet PWR_MGMT; Number of Pins: 2; Package Reference: 603; Depth: 0.8mm; Mount: SurfaceMount; Package Description: 2-Pin Surface Mount Device, Body 1.6 x 0.85 mm; Datasheet Version: 02/2017; Length: 1.6mm; Lead Free: LeadFree; Height: 0.45mm; Number of Terminations: 2; Max Power Dissipation: 100mW; Min Operating Temperature: -55degC; Datasheet URL: https://industrial.panasonic.com/cdbs/www-data/pdf/RDA0000/AOA0000C304.pdf; Termination: SMD/SMT; Case Code (Metric): 1608; Case Code (Imperial): 0603; Tolerance: 1%; Max Operating Temperature: 155degC; RoHSCompliant: true; Voltage Rating (DC): 75V; Radiation Hardening: No; Packaging: TapeandReel; Composition: ThickFilm; Mounting Technology: SurfaceMount; Manufacturer URL: http://www.panasonic.com/; Width: 0.031inch; REACH SVHC: NoSVHC; Contact Plating: Tin; Military Standard: Not; Package Quantity: 1
U3 = CMP-12757-000006-1: IC REG BUCK 3.3V 2A TSOT26; Manufacturer: Diodes Inc.; Output Type: Fixed; Min Supply Voltage: 3.8V; Number Of Outputs: 1; Max Junction Temp: +160°C; Nominal Supply Current: 22uA; Standoff Height: 0.01mm; Switching Frequency: 1.1MHz; Max Supply Voltage: 32V; ComponentLink2Description: Datasheet; Device Class L1: Integrated Circuits (ICs); Temperature: to +160°C; Device Class L3: Voltage Regulators - Switching; RoHS: TRUE; Octopart: https://octopart.com/ap63203wu-7-diodes+inc.-98099550; Output Voltage: 3.3V; Lead Free: Yes; ComponentLink2URL: https://www.diodes.com/assets/Datasheets/AP63200-AP63201-AP63203-AP63205.pdf; Digikey Description: IC REG BUCK 3.3V 2A TSOT26; Footprint Url: https://www.diodes.com/assets/Package-Files/TSOT26.pdf; Ambient Temperature Range High: +85°C; Height: 1mm; Automotive: No; Temperature Range High: +160°C; Switching Topology: Buck; Output Current: 2A; Package: TSOT26; Category: IC; Mouser Description: AP63203 Series 3.3 V 2 A SMT Fixed Low IQ Synchronous Buck - TSOT-26; Device Class L2: Power Management ICs; Ambient Temperature Range Low: -40°C; Manufacturer Part Number: AP63203WU-7